# EAGLE schematic Carloop-v1.1 (EAGLE 7.5.0)
DATABASE: /home/monkbroc/eagle/PARTSDB.txt
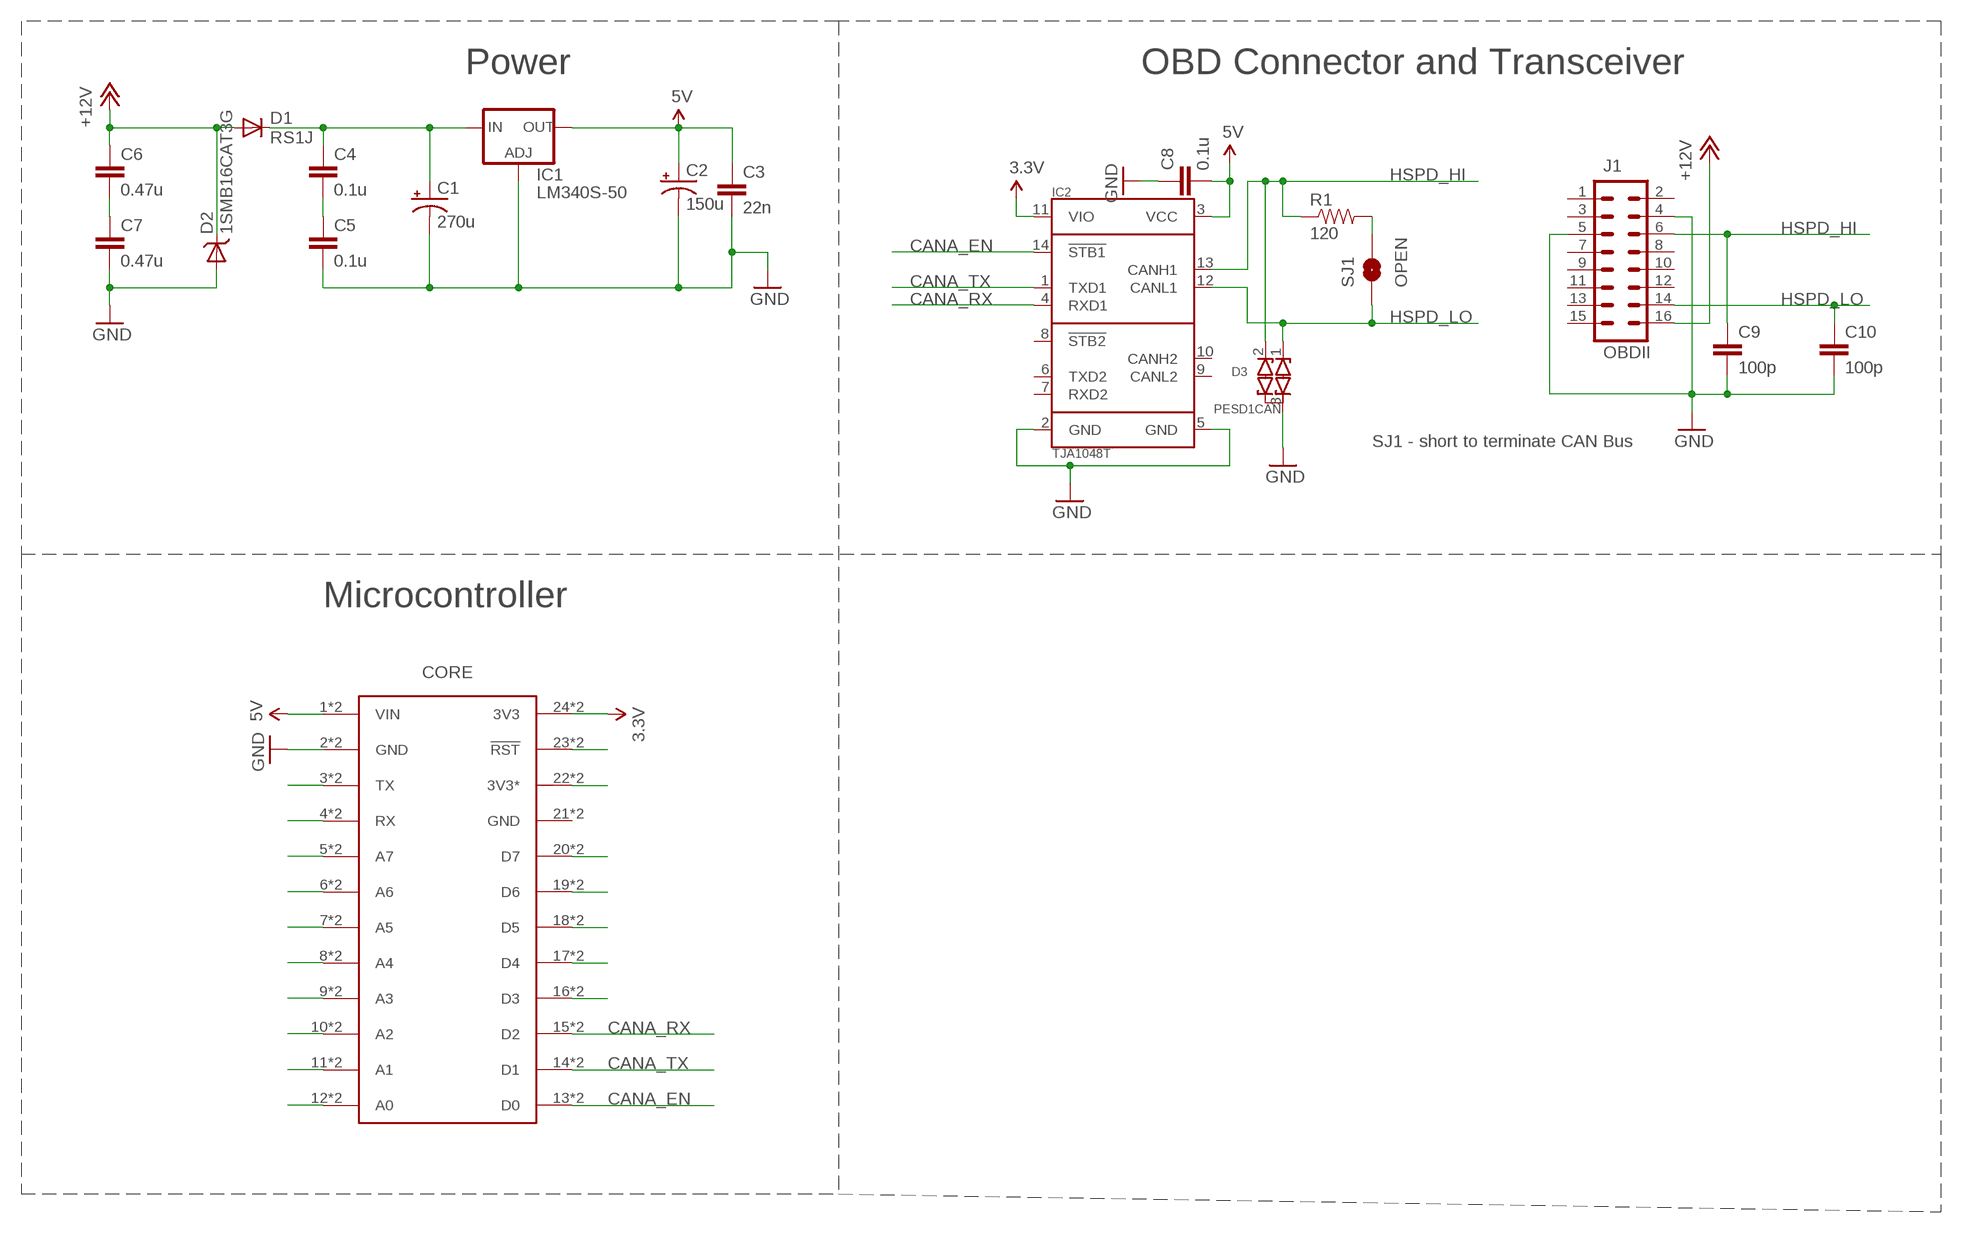
[diagram p0: schematic, sheet 1]

## Parts
C1  270u  CAP_POL8MMX20MM-FLAT  [CPOL-8MMX20MM-FLAT]
C2  150u  CAP_POL5MMX2D  [CPOL-5MMX2D]
C3  22n  CAP0402-CAP  [0402-CAP]
C4  0.1u  CAP0805  [0805]
C5  0.1u  CAP0805  [0805]
C6  0.47u  CAP0805  [0805]
C7  0.47u  CAP0805  [0805]
C8  0.1u  CAP0402-CAP  [0402-CAP]
C9  100p  CAP0402-CAP  [0402-CAP]
C10  100p  CAP0402-CAP  [0402-CAP]
CORE  SPARK_COREOUTSIDE  [SPARK_CORE_OUTSIDE]
D1  RS1J  DIODESMA  [SMA-DIODE]
D2  1SMB16CAT3G  DIODE-TVS-SMB  [SMB-DIODE]
D3  PESD1CAN  DIODE_ESD_DUAL-SOT-23  [SOT23]
IC1  LM340S-50  V_REG_317DPACK  [V-REG_DPACK]
IC2  TJA1048T  TJA1048-SO14  [SO14]
J1  OBDII  M08X2STRAIGHT  [OBDII-STRAIGHT]
R1  120  RESISTOR0402-RES  [0402-RES]
SJ1  OPEN  SOLDERJUMPERNO  [SJ_2S-NO]

## Nets
3.3V: CORE.24(3V3) CORE.@24(3V3) IC2.11(VIO)
5V: C2.1(+) C3.1 C8.2 CORE.1(VIN) CORE.@1(VIN) IC1.4(OUT) IC2.3(VCC)
+12V: C6.1 D1.A D2.C J1.16
CANA_EN: CORE.13(D0) CORE.@13(D0) IC2.14(!STB1)
CANA_RX: CORE.15(D2) CORE.@15(D2) IC2.4(RXD1)
CANA_TX: CORE.14(D1) CORE.@14(D1) IC2.1(TXD1)
GND: C1.1(-) C2.2(-) C3.2 C5.2 C7.2 C8.1 C9.2 C10.2 CORE.2(GND) CORE.@2(GND) D2.A D3.3(COM) IC1.1(ADJ) IC2.2(GND) IC2.5(GND) J1.4 J1.5
HSPD_HI: C9.1 D3.2(C2) IC2.13(CANH1) J1.6 R1.1
HSPD_LO: C10.1 D3.1(C1) IC2.12(CANL1) J1.14 SJ1.1
N$1: R1.2 SJ1.2
N$7: C6.2 C7.1
N$10: CORE.23(!RST) CORE.@23(!RST)
N$11: CORE.22(3V3*) CORE.@22(3V3*)
N$12: CORE.20(D7) CORE.@20(D7)
N$13: CORE.19(D6) CORE.@19(D6)
N$14: CORE.18(D5) CORE.@18(D5)
N$15: CORE.17(D4) CORE.@17(D4)
N$16: CORE.16(D3) CORE.@16(D3)
N$17: CORE.12(A0) CORE.@12(A0)
N$18: CORE.11(A1) CORE.@11(A1)
N$19: CORE.10(A2) CORE.@10(A2)
N$20: CORE.9(A3) CORE.@9(A3)
N$21: C4.2 C5.1
N$22: C1.2(+) C4.1 D1.C IC1.3(IN)
N$23: CORE.8(A4) CORE.@8(A4)
N$24: CORE.7(A5) CORE.@7(A5)
N$25: CORE.6(A6) CORE.@6(A6)
N$26: CORE.5(A7) CORE.@5(A7)
N$27: CORE.4(RX) CORE.@4(RX)
N$28: CORE.3(TX) CORE.@3(TX)
Unconnected: IC2.6(TXD2) IC2.7(RXD2) IC2.8(!STB2) IC2.9(CANL2) IC2.10(CANH2) J1.1 J1.2 J1.3 J1.7 J1.8 J1.9 J1.10 J1.11 J1.12 J1.13 J1.15

## Notes on the sheet
- Power | OBD Connector and Transceiver
- SJ1 - short to terminate CAN Bus
- Microcontroller

## Power pins joined to a net without a drawn wire
GND: CORE.21(GND) CORE.@21(GND)

## Library data of the parts
C1 = BUG:CAP_POL: Capacitor Polarized These are standard SMD and PTH capacitors. Normally 10uF, 47uF, and 100uF in electrolytic and tantalum varieties. Always verify the external diameter of the through hole cap, it varies with capacity, voltage, and manufacturer. The EIA devices should be standard.; PARTNO: EEU-TP1V271LB
C2 = BUG:CAP_POL: Capacitor Polarized These are standard SMD and PTH capacitors. Normally 10uF, 47uF, and 100uF in electrolytic and tantalum varieties. Always verify the external diameter of the through hole cap, it varies with capacity, voltage, and manufacturer. The EIA devices should be standard.; PARTNO: EKZE160ELL680MF07D
C3 C6 C7 = BUG:CAP: Capacitor Standard 0603 ceramic capacitor, and 0.1" leaded capacitor.; PARTNO: CC0805KKX7R9BB474
C4 C9 C10 = BUG:CAP: Capacitor Standard 0603 ceramic capacitor, and 0.1" leaded capacitor.; PARTNO: 06035A101JAT2A
C5 = BUG:CAP: Capacitor Standard 0603 ceramic capacitor, and 0.1" leaded capacitor.; PARTNO: CC0805KRX7R9BB104
C8 = BUG:CAP: Capacitor Standard 0603 ceramic capacitor, and 0.1" leaded capacitor.; PARTNO: CC0603JRX7R7BB104
CORE = Spark:SPARK_CORE; PARTNO: PPPC122LFBN-RC
D1 = BUG:DIODE: Diode These are standard reverse protection diodes and small signal diodes. SMA package can handle up to about 1A. SOD-323 can handle about 200mA. What the SOD-323 package when ordering, there are some mfgs out there that are 5-pin packages.; PARTNO: RS1J-E3/5AT; ROLE: Reverse protection
D2 = BUG:DIODE-TVS; PARTNO: 1SMB16CAT3G; ROLE: Overvoltage protection
D3 = BUG:DIODE_ESD_DUAL: Dual ESD Diode, with a common anode; PARTNO: PESD1CAN,215
IC1 = SparkFun-PowerIC:V_REG_317: Voltage Regulator Standard LM317 adjustable voltage regulator. AOI (Adjust Output Input). Google 'LM317 Calculator' for easy to use app to get the two resistor values needed. 240/720 for 5V output. 240/390 for 3.3V output. Spark Fun Electronics SKU : COM-00527; PARTNO: MC7805BDTRKG
IC2 = BUG:TJA1048; PARTNO: TJA1048T,118
J1 = BUG:M08X2: .1" headers, two rows of 8 each; PARTNO: OBD-II
R1 = BUG:RESISTOR: Resistor Basic schematic elements and footprints for 0603, 1206, and PTH resistors.; PARTNO: RC0603FR-07120RL
SJ1 = SparkFun-Passives:SOLDERJUMPER: Solder Jumper Standard SMD solder jumper. Used to automate production. Two varients : Normally Open and Normally Closed are the same, but have different paste layers. NC will have a large amount of paste and should jumper during reflow.